# Altium project LM2736.PrjPcb
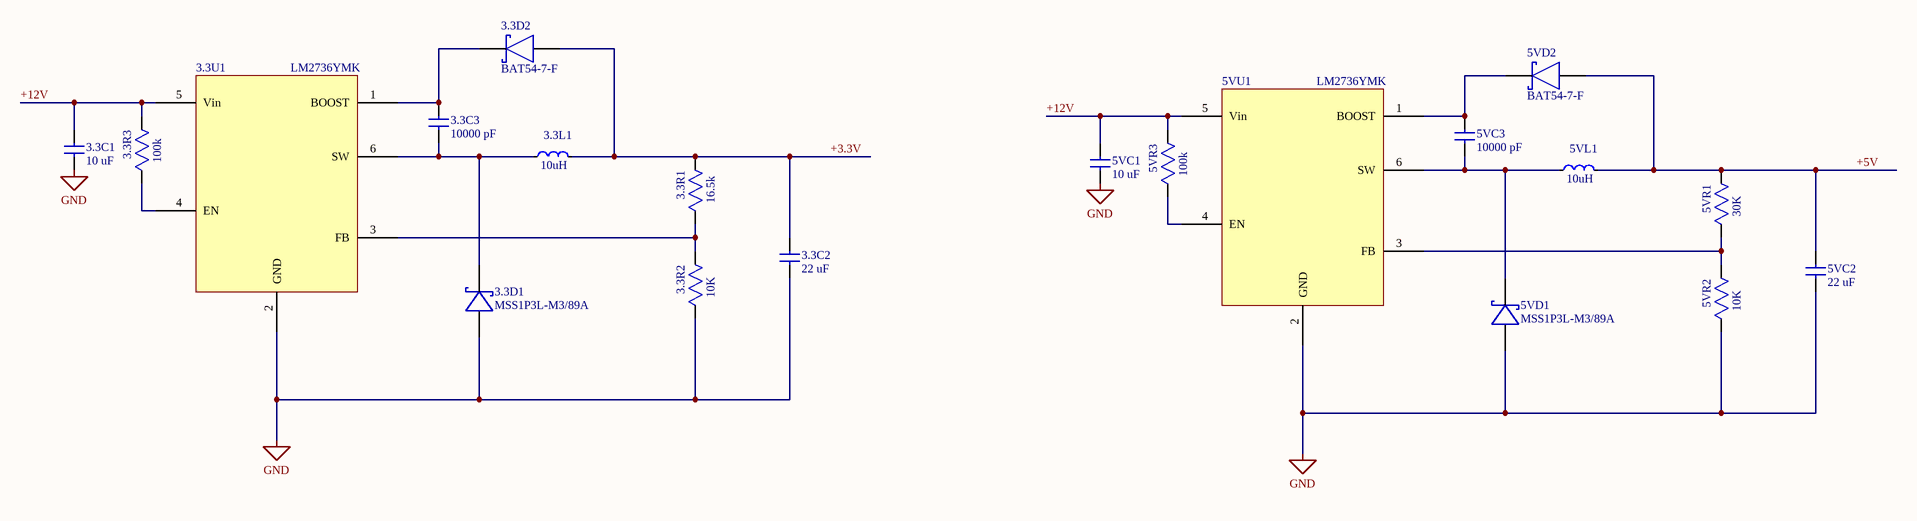
[diagram p0: LM2736.SchDoc]
1 sheet, 20 parts. Net scope: global (net labels, ports and power ports of the same name join across sheets).
Board file: LM2736.PcbDoc

## Sheet LM2736.SchDoc
size B

### Parts
3.3C1  value 10 uF  [0805_Capacitor]  (hidden comment: CAP 10 uF)
3.3C2  value 22 uF  [0805_Capacitor]  (hidden comment: CAP 22 uF)
3.3C3  value 10000 pF  [0805_Capacitor]  (hidden comment: CAP 10000pF)
3.3D1  Manufacturer PN: MSS1P3L-M3/89A  [MicroSMP]  (hidden comment: SCHOTTKY 30V 1A)
3.3D2  Manufacturer PN: BAT54-7-F  [SOT-23]  (hidden comment: SCHOTTKY 30V 1A)
3.3L1  value 10uH  [LPS4018_inductor]  (hidden comment: L_10uH_20%)
3.3R1  value 16.5k  [0805_Resistor]  (hidden comment: R_0805_16.5k_1%)
3.3R2  value 10K  [0805_Resistor]  (hidden comment: R_0805_10k_1%)
3.3R3  value 100k  [0805_Resistor]  (hidden comment: R_0805_100k_1%)
3.3U1  Manufacturer PN: LM2736YMK  [TSOT95P285X100-6M]  (hidden comment: Short Part Description)
5VC1  value 10 uF  [0805_Capacitor]  (hidden comment: CAP 10 uF)
5VC2  value 22 uF  [0805_Capacitor]  (hidden comment: CAP 22 uF)
5VC3  value 10000 pF  [0805_Capacitor]  (hidden comment: CAP 10000pF)
5VD1  Manufacturer PN: MSS1P3L-M3/89A  [MicroSMP]  (hidden comment: SCHOTTKY 30V 1A)
5VD2  Manufacturer PN: BAT54-7-F  [SOT-23]  (hidden comment: SCHOTTKY 30V 1A)
5VL1  value 10uH  [LPS4018_inductor]  (hidden comment: L_10uH_20%)
5VR1  value 30K  [0805_Resistor]  (hidden comment: R_0805_30K_1%)
5VR2  value 10K  [0805_Resistor]  (hidden comment: R_0805_10k_1%)
5VR3  value 100k  [0805_Resistor]  (hidden comment: R_0805_100k_1%)
5VU1  Manufacturer PN: LM2736YMK  [TSOT95P285X100-6M]  (hidden comment: Short Part Description)

### Nets
GND: 3.3C1.2 3.3C2.2 3.3D1.1 3.3R2.2 3.3U1.2(GND) 5VC1.2 5VC2.2 5VD1.1 5VR2.2 5VU1.2(GND)
+3.3V: 3.3C2.1 3.3D2.1 3.3L1.2 3.3R1.1
+5V: 5VC2.1 5VD2.1 5VL1.2 5VR1.1
+12V: 3.3C1.1 3.3R3.1 3.3U1.5(Vin) 5VC1.1 5VR3.1 5VU1.5(Vin)
Net3.3C3_1: 3.3C3.1 3.3D2.3 3.3U1.1(BOOST)
Net3.3C3_2: 3.3C3.2 3.3D1.2 3.3L1.1 3.3U1.6(SW)
Net3.3R1_2: 3.3R1.2 3.3R2.1 3.3U1.3(FB)
Net3.3R3_2: 3.3R3.2 3.3U1.4(EN)
Net5VC3_1: 5VC3.1 5VD2.3 5VU1.1(BOOST)
Net5VC3_2: 5VC3.2 5VD1.2 5VL1.1 5VU1.6(SW)
Net5VR1_2: 5VR1.2 5VR2.1 5VU1.3(FB)
Net5VR3_2: 5VR3.2 5VU1.4(EN)

### Library data of the parts
3.3C1 5VC1 = C_0805_10uF: CAP CERM 10 uF; Package: 0805; Known Distributors: Digikey; ComponentLink1Description: Datasheet; ComponentLink1URL: SVN Datasheet URL
3.3C2 5VC2 = C_0805_22uF: CAP CER 22UF 16V X5R 10% 0805; Manufacturer: TDK; Manufacturer PN: C2012X5R1C226K; SVP Creator: Matt Rogge; Package: 0805; Known Distributors: digikey; ComponentLink1Description: Datasheet; ComponentLink1URL: http://www.tdk.com/pdf/general_B11.pdf; Price: .88
3.3C3 5VC3 = C_0805_10000pF: CAP CERM 10000PF; Manufacturer: AVX; Manufacturer PN: 08051A200JAT2A; SVP Creator: Jonathan Nutzmann; Package: 0805; Known Distributors: Digikey; ComponentLink1Description: Datasheet; ComponentLink1URL: SVN Datasheet URL; Price: 0.231
3.3D1 5VD1 = D_Schottky_MSS1P3L-M3/89A: DIODE SCHOTTKY 1A 30V MICROSMP; Manufacturer: Vishay; SVP Creator: Brett Paulsen; Vf: 0.5V @ 1A; Package: MicroSMP; Known Distributors: Digi-Key; Price: 0.47; ComponentLink1Description: Datasheet; Voltage: 30V; Current: 1A
3.3D2 5VD2 = D_Schottky_BAT54-7-F: DIODE SCHOTTKY 30V 200MW SOT23-3; Manufacturer: Diodes Inc; SVP Creator: Brett Paulsen; Current: 200mA; Vf: 0.8V @ 100mA; Package: SOT23-3; Known Distributors: Digi-Key; Price: .39; ComponentLink1Description: Datasheet; Voltage: 30V
3.3L1 5VL1 = L_10uH_20%: INDUCTOR PWR 10UH 20% SHIELD SMD; Manufacturer: Coilcraft; Manufacturer PN: LPS4018-103; Irms: 1.25A; SVP Creator: Brett Paulsen; Isat: 1.3A; Package: 4.00mm x 4.00mm x 1.8mm); Known Distributor: Digikey; ComponentLink1Description: Datasheet
3.3R1 = R_0805_16.5k_1%: RES 16.5k OHM 1/8W 1% 0805 SMD; Power Rating: .125W; SVP Creator: Brett Paulsen; Package: 0805; Known Distributor: Digikey; ComponentLink1Description: Datasheet
3.3R2 5VR2 = R_0805_10K_1%: RES 10K OHM 1/8W 1% 0805 SMD; Power Rating: .125W; SVP Creator: Jonathan Nutzmann; Package: 0805; Known Distributor: Digikey; ComponentLink1Description: Datasheet
3.3R3 5VR3 = R_0805_100k_1%: RES 100K OHM 1/8W 1% 0805 SMD; Manufacturer: Rohm Semiconductor; Power Rating: .125W; SVP Creator: Jonathan Nutzmann; Package: 0805; Known Distributor: Digikey; ComponentLink1Description: Datasheet
3.3U1 5VU1 = U_LM2736YMK: IC REG PWM STPDWN 750 mA; Manufacturer: National Semiconductor (TI?); SVP Creator: Brett Paulsen; SVP Reviewer 1: Arlo Siemsen; Package: TSOT23-6; Known Distributors: Digikey; ComponentLink1Description: Datasheet; ComponentLink1URL: SVN Datasheet URL; Price: FREE
5VR1 = R_0805_30K_1%: RES 30K OHM 1/8W 1% 0805 SMD; Power Rating: .125W; SVP Creator: Brett Paulsen; Package: 0805; Known Distributor: Digikey; ComponentLink1Description: Datasheet